# Altium schematic sheet battery.SchDoc
size A4
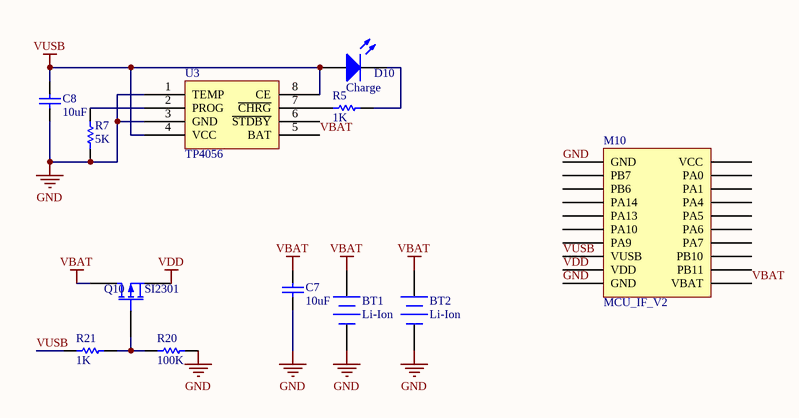
[diagram p0: battery.SchDoc]

## Parts
BT1  Li-Ion  [HDR1X2H]
BT2  Li-Ion  [Hearder2 2]
C7  value 10uF  [C-1608[0603]]  (hidden comment: Cap Semi)
C8  value 10uF  [C-1608[0603]]  (hidden comment: Cap Semi)
D10  Charge  [LED-1608[0603]-R]
M10  MCU_IF_V2  [MCU_IF_V2]
Q10  SI2301  [SOT23B]
R5  value 1K  [R-1608[0603]]  (hidden comment: Res Semi)
R7  value 5K  [R-1608[0603]]  (hidden comment: Res Semi)
R20  value 100K  [R-1608[0603]]  (hidden comment: Res Semi)
R21  value 1K  [R-1608[0603]]  (hidden comment: Res Semi)
U3  TP4056  [TP4056]

## Nets
GND: BT1.2(-) BT2.2(-) C7.1 C8.1 M10.1(GND) M10.10(GND) R7.1 R20.2 U3.1(TEMP) U3.3(GND)
VBAT: BT1.1(+) BT2.1(+) C7.2 M10.11(VBAT) Q10.1(D) U3.5(BAT)
VDD: M10.9(VDD) Q10.3(S)
VUSB: C8.2 D10.1(A) M10.8(VUSB) R21.1 U3.4(VCC) U3.8(CE)
NetD10_2: D10.2(K) R5.1
NetQ10_2: Q10.2(G) R20.1 R21.2
NetR5_2: R5.2 U3.7(~{CHRG})
NetR7_2: R7.2 U3.2(PROG)

Not connected (* = marked no-connect by the designer): M10 2(PB7) 3(PB6) 4(PA14) 5(PA13) 6(PA10) 7(PA9) 12(PB11) 13(PB10) 14(PA7) 15(PA6) 16(PA5) 17(PA4) 18(PA1) 19(PA0) 20(VCC); U3 6(~{STDBY})

## Library data of the parts
BT1 BT2 = Battery: Multicell Battery; Published: 24-Mar-1999; LatestRevisionDate: 17-Jul-2002; LatestRevisionNote: Re-released for DXP Platform.; PackageReference: BAT-2; Publisher: Altium Limited
C7 C8 = Cap Semi: Capacitor (Semiconductor SIM Model); Published: 8-Jun-2000; LatestRevisionDate: 17-Jul-2002; LatestRevisionNote: Re-released for DXP Platform.; PackageReference: C1206; Publisher: Altium Limited
D10 = LED2: Typical RED, GREEN, YELLOW, AMBER GaAs LED; Published: 8-Jun-2000; LatestRevisionDate: 17-Jul-2002; LatestRevisionNote: Re-released for DXP Platform.; PackageDocument: Feb-2002; PackageReference: 3.2X1.6X1.1; Publisher: Altium Limited
M10 = MCU_IF_V1
Q10 = MOSFET-P: P-Channel MOSFET; pin to pad: 1>3 2>1 3>2; PackageDocument: 1995/1996; Published: 8-Jun-2000; LatestRevisionDate: 17-Jul-2002; LatestRevisionNote: Re-released for DXP Platform.; PackageReference: E3; Publisher: Altium Limited
R5 R7 R20 R21 = Res Semi: Semiconductor Resistor; Published: 8-Jun-2000; LatestRevisionDate: 17-Jul-2002; LatestRevisionNote: Re-released for DXP Platform.; PackageReference: AXIAL-0.5; Publisher: Altium Limited